# EAGLE design ESP8266-01 Solid State Relay 2016-01-18b (EAGLE 7.4.0)
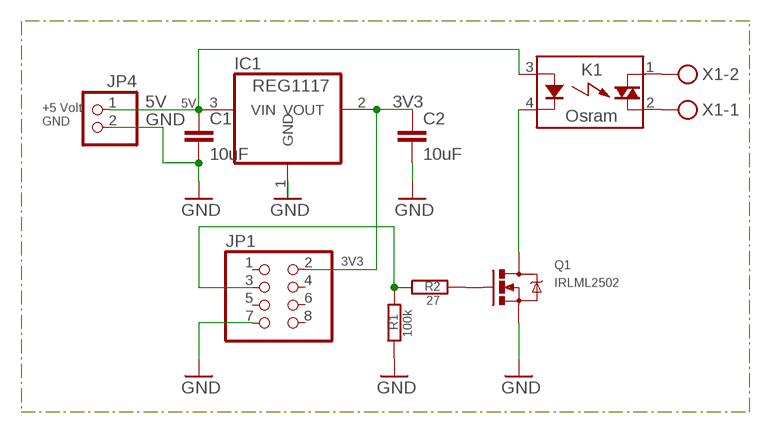
[diagram p0: schematic, sheet 1]

## Parts
C1  10uF  C-EUC1206  [C1206]
C2  10uF  C-EUC1206  [C1206]
IC1  REG1117  [SOT223]
JP1  PINHD-2X4  [2X04]
JP4  PINHD-1X2  [1X02]
K1  Osram  S202SE1  [S2XXEX]
Q1  IRLML2502  MOSFET-NCHANNELAO3404A  [SOT23-3]
R1  100k  R-EU_R0805  [R0805]
R2  27  R-EU_R0805  [R0805]
X1  W237-102  [W237-102]

## Nets
3V3: C2.1 IC1.2(VOUT) JP1.2
5V: C1.1 IC1.3(VIN) JP4.1 K1.3(A)
GND: C1.2 C2.2 IC1.1(GND) JP1.7 JP4.2 Q1.2(S) R1.1
N$1: Q1.1(G) R2.2
N$2: K1.2(DS2) X1.1
N$3: K1.4(K) Q1.3(D)
N$4: K1.1(DS1) X1.2
N$8: JP1.3 R1.2 R2.1
Unconnected: JP1.1 JP1.4 JP1.5 JP1.6 JP1.8

## Notes on the sheet
- +5 Volt
  GND

## Library data of the parts
C1 C2 = rcl:C-EU: CAPACITOR, European symbol
IC1 = burr-brown:REG1117: 800mA and 1A Low Dropout (LDO) Positive Regulator 1.8V, 2.5V, 2.85V, 3.3V, 5V, and Adj; MPN: REG1117; OC_FARNELL: 1097566; OC_NEWARK: 14P6981
JP1 = pinhead:PINHD-2X4: PIN HEADER
JP4 = pinhead:PINHD-1X2: PIN HEADER
K1 = relay:S2*: SIP Type SSR for Medium Power Control SHARP Source: 168149-da-01-en-Solid_State_Relais_S_202_SE1_SE2.pdf; OC_FARNELL: unknown; OC_NEWARK: unknown
Q1 = SparkFun-DiscreteSemi:MOSFET-NCHANNEL: Common NMOSFET Parts MFG P/N Store ID Prod ID FDD8780 TRANS-09984 SI7820DN TRANS-11055 FDS6630A IC-08089 2N7002PW TRANS-11151 FQP30N06L COM-10213 TRANS-10060 BSS123LT1G TRANS-08345 BSS138 TRANS-00830 BS170 2N7000; PROD_ID: TRAN-12988
R1 R2 = rcl:R-EU_: RESISTOR, European symbol
X1 = con-wago-500:W237-102: WAGO SCREW CLAMP; MPN: 237-102; OC_FARNELL: unknown; OC_NEWARK: 70K9898

## Board
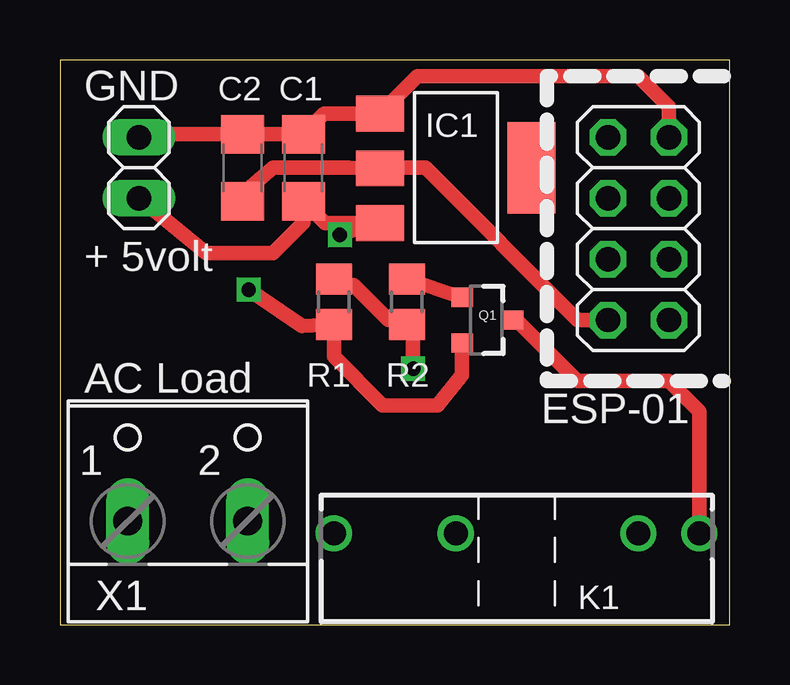
[diagram p1: board, top side]
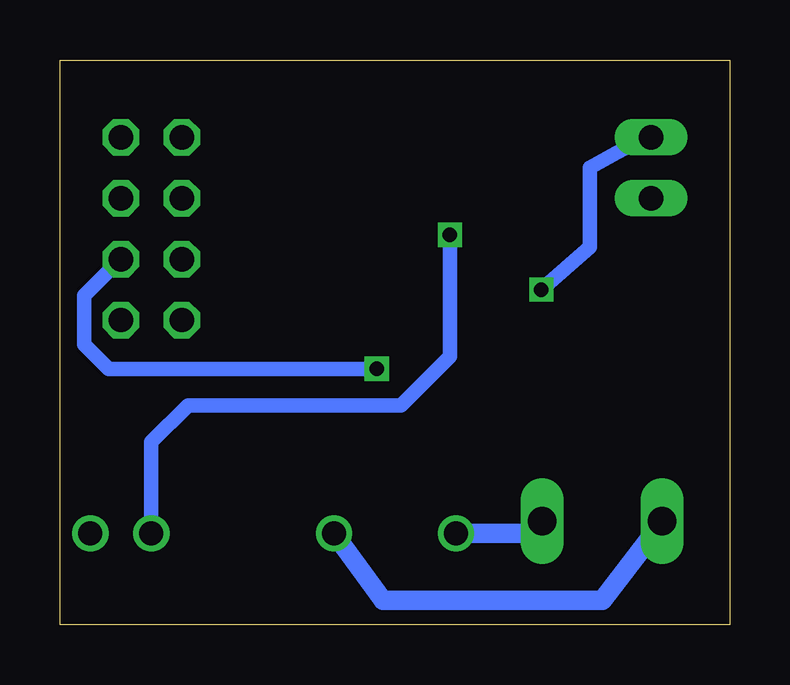
[diagram p2: board, bottom side, seen from below]

Size 27.93 x 23.55 mm. Coordinates in mm from the lower left corner, seen from the top.
Outline: 27.93,0 27.93,23.55 0,23.55 0,0 27.93,0
Copper layers (1*16): Top 0.035mm / dielectric 1.5mm / Bottom 0.035mm
Design rules "default": minimum track width 10mil, minimum drill 24mil, track to track 8mil, track to pad 8mil, pad to pad 8mil, via to via 8mil, smd to smd 8mil, copper to edge 40mil, drill to drill 8mil, minimum pad ring 10mil, minimum via ring 8mil, stop-mask expansion 4mil, vias tented up to drill 0mil, thermal gap 10mil
tKeepout: area 0.5,0.5 to 19,9.9

### Footprints (pad centres in the part's own frame; a part is rotated, then mirrored left to right if it is on the bottom)
C1206 = smd 1.6 x 1.8: 1 -1.4,0; 2 1.4,0
SOT223 = smd 1.499 x 2.007: 1 -2.261,-3.15; 2 0.025,-3.15; 3 2.311,-3.15 | smd 3.81 x 2.007: 4 0,3.15
2X04 = drill 1.016 octagon: 1 -3.81,-1.27; 2 -3.81,1.27; 3 -1.27,-1.27; 4 -1.27,1.27; 5 1.27,-1.27; 6 1.27,1.27; 7 3.81,-1.27; 8 3.81,1.27
1X02 = drill 1.016 long: 1 -1.27,0; 2 1.27,0
S2XXEX = drill 1: 1 -7.62,0; 2 -2.54,0; 3 5.08,0; 4 7.62,0
SOT23-3 = smd 0.8 x 0.9: 1 -0.95,-1; 2 0.95,-1; 3 0,1.1
R0805 = smd 1.3 x 1.5: 1 -0.95,0; 2 0.95,0
W237-102 = drill 1.194 long: 1 -2.5,-1.27; 2 2.5,-1.27

### Placement (x,y rotation side)
C1  10.15,19.05 90 top
C2  7.61,19.05 90 top
IC1  16.5,19.05 270 top
JP1  24.12,16.51 90 top
JP4  3.29,19.05 90 top
K1  19.04,3.81 0 top
Q1  17.77,12.7 270 top
R1  11.42,13.46 90 top
R2  14.47,13.46 90 top
X1  5.32,5.59 0 top

### Tracks (layer width: path | path; a pad name or v marks a point on that pad's centre or on a via)
3V3
  Top 0.406: C2.1 7.23,17.65 | 13.38,19.05 IC1.2
  Top 0.61: 7.23,17.65 8.88,19.05 12.05,19.05 IC1.2 | JP1.2 21.58,12.7 15.23,19.05 13.38,19.05
5V  (via drill 0.6)
  Top 0.61: JP4.1 6.09,15.49 8.88,15.49 10.15,16.76 C1.1 11.06,16.74 IC1.3 13.33,16.76 v11.67,16.26
  Bottom 0.61: v11.67,16.26 11.67,11.18 13.71,9.14 22.6,9.14 24.12,7.62 K1.3
GND  (via drill 0.6)
  Top 0.406: Q1.2 16.75,11.73 | C1.2 JP4.2
  Top 0.61: JP4.2 3.93,20.45 C2.2 C1.2 11.01,21.31 IC1.1 14.9,22.86 24.12,22.86 25.39,21.59 JP1.7 | 16.75,11.73 16.75,10.41 15.74,9.14 13.45,9.14 11.42,11.18 R1.1 10.08,12.45 v7.86,13.97
  Bottom 0.61: v7.86,13.97 5.83,15.75 5.83,19.05 3.55,20.32 JP4.2
N$1
  Top 0.61: Q1.1 R2.2
N$2
  Bottom 0.813: X1.1 2.78,4.32 5.32,1.02 14.47,1.02 K1.2
N$3
  Top 0.406: 19.04,12.7 Q1.3
  Top 0.61: K1.4 26.66,8.89 25.39,10.16 21.58,10.16 19.04,12.7
N$4
  Bottom 0.813: X1.2 8.33,3.81 K1.1
N$8  (via drill 0.6)
  Top 0.61: R1.2 12.25,14.16 13.71,12.7 R2.1 14.72,12.51 v14.72,10.67
  Bottom 0.61: v14.72,10.67 25.9,10.67 26.91,11.68 26.91,13.72 JP1.3

### Text on the board
tPlace: GND | + 5volt | AC Load | ESP-01